# Altium schematic sheet DBBC7505S-F.SchDoc
size A2; SheetNumber: 1; SheetTotal: 1
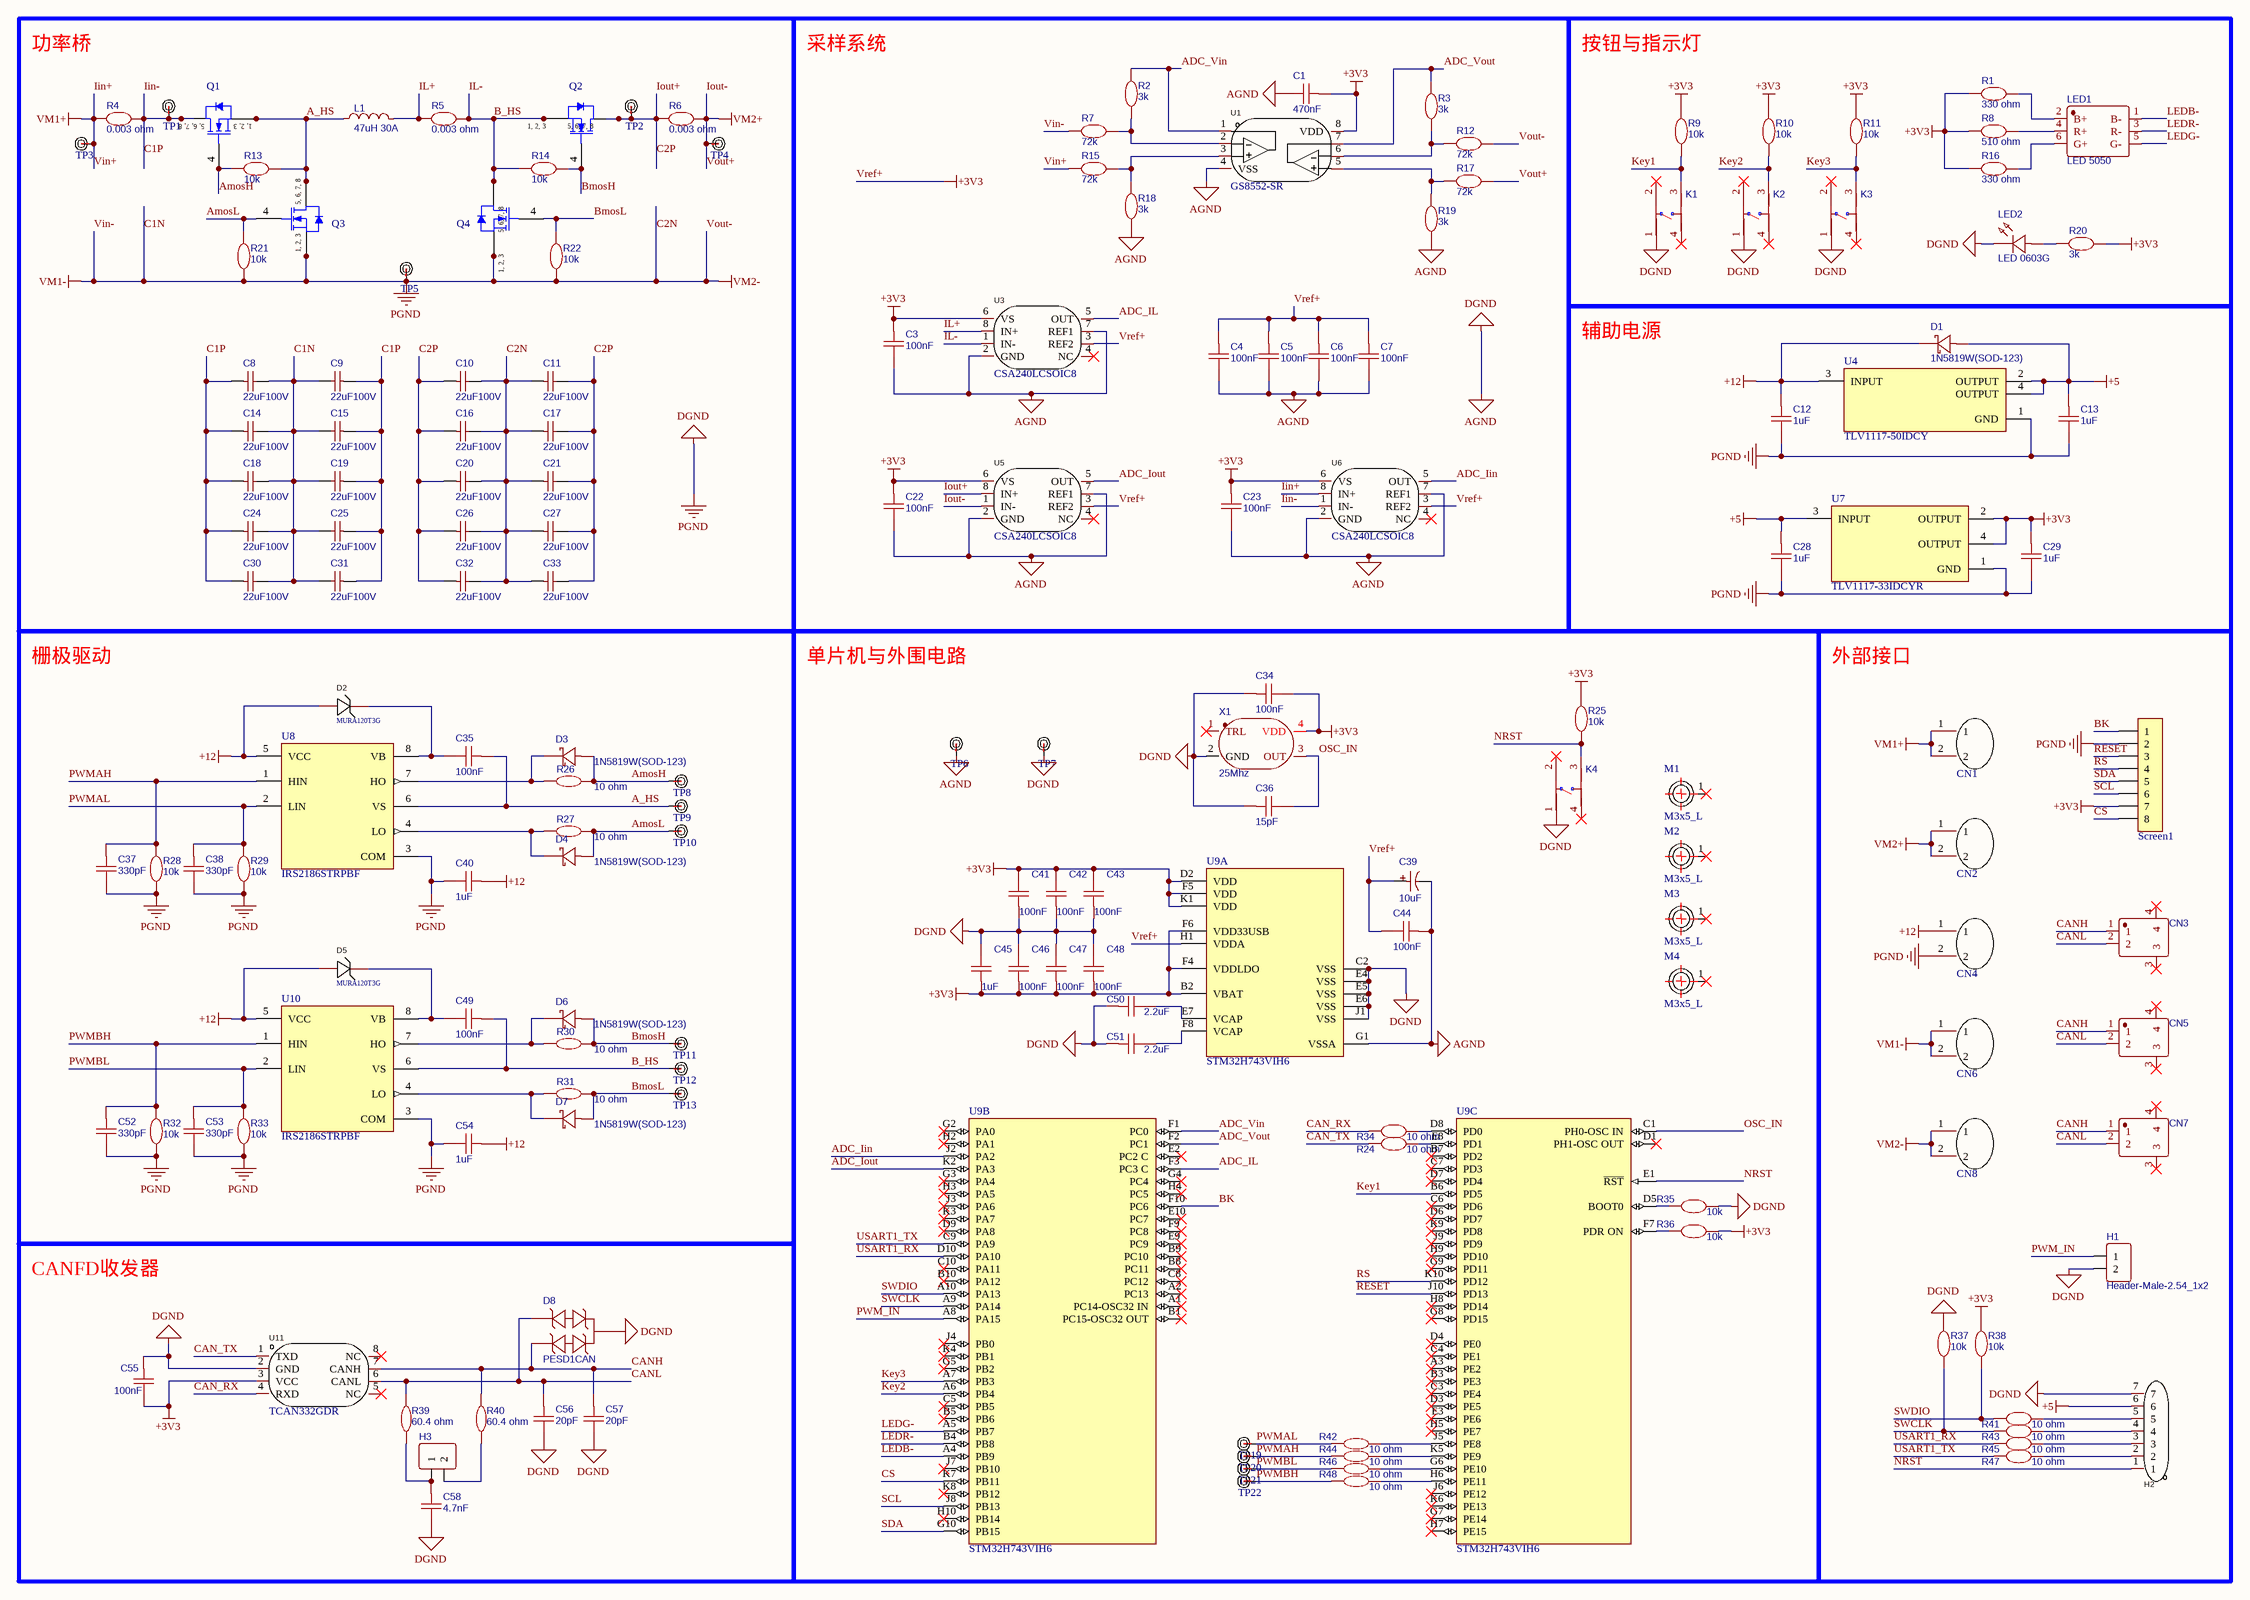
[diagram p0: DBBC7505S-F.SchDoc]

## Parts
C1  470nF  [C0402]
C3  100nF  [C0402]
C4  100nF  [C0402]
C5  100nF  [C0402]
C6  100nF  [C0402]
C7  100nF  [C0402]
C8  22uF100V  [C1206]
C9  22uF100V  [C1206]
C10  22uF100V  [C1206]
C11  22uF100V  [C1206]
C12  1uF  [C0402]
C13  1uF  [C0402]
C14  22uF100V  [C1206]
C15  22uF100V  [C1206]
C16  22uF100V  [C1206]
C17  22uF100V  [C1206]
C18  22uF100V  [C1206]
C19  22uF100V  [C1206]
C20  22uF100V  [C1206]
C21  22uF100V  [C1206]
C22  100nF  [C0402]
C23  100nF  [C0402]
C24  22uF100V  [C1206]
C25  22uF100V  [C1206]
C26  22uF100V  [C1206]
C27  22uF100V  [C1206]
C28  1uF  [C0402]
C29  1uF  [C0402]
C30  22uF100V  [C1206]
C31  22uF100V  [C1206]
C32  22uF100V  [C1206]
C33  22uF100V  [C1206]
C34  100nF  [C0402]
C35  100nF  [C0402]
C36  15pF  [C0402]
C37  330pF  [C0402]
C38  330pF  [C0402]
C39  10uF  [CD A(3216)]
C40  1uF  [C0402]
C41  100nF  [C0402]
C42  100nF  [C0402]
C43  100nF  [C0402]
C44  100nF  [C0402]
C45  1uF  [C0402]
C46  100nF  [C0402]
C47  100nF  [C0402]
C48  100nF  [C0402]
C49  100nF  [C0402]
C50  2.2uF  [C0402]
C51  2.2uF  [C0402]
C52  330pF  [C0402]
C53  330pF  [C0402]
C54  1uF  [C0402]
C55  100nF  [C0402]
C56  20pF  [C0402]
C57  20pF  [C0402]
C58  4.7nF  [C0402]
CN1  1729128  [CONN-TH_2P-P5.08]  (value not drawn)
CN2  1729128  [CONN-TH_2P-P5.08]  (value not drawn)
CN3  A1257WR-S-2P  [CONN-SMD_A1257WR-S-2P]  (value not drawn)
CN4  1729128  [CONN-TH_2P-P5.08]  (value not drawn)
CN5  A1257WR-S-2P  [CONN-SMD_A1257WR-S-2P]  (value not drawn)
CN6  1729128  [CONN-TH_2P-P5.08]  (value not drawn)
CN7  A1257WR-S-2P  [CONN-SMD_A1257WR-S-2P]  (value not drawn)
CN8  1729128  [CONN-TH_2P-P5.08]  (value not drawn)
D1  1N5819W(SOD-123)  [SOD-123]
D2  MURA120T3G  [SMA]
D3  1N5819W(SOD-123)  [SOD-123]
D4  1N5819W(SOD-123)  [SOD-123]
D5  MURA120T3G  [SMA]
D6  1N5819W(SOD-123)  [SOD-123]
D7  1N5819W(SOD-123)  [SOD-123]
D8  PESD1CAN  [SOT23-3L]
H1  Header-Male-2.54_1x2  [HDR2.54-LI-2P]
H2  7P卧贴排母  [HDR-SMD_7P-P2.54-H-F-L11.5]  (value not drawn)
H3  Header-Male-2.54_1x2  [HDR2.54-LI-2P]  (value not drawn)
K1  TSW SMD-6*6*5  [TSW SMD-6*6*5]  (value not drawn)
K2  TSW SMD-6*6*5  [TSW SMD-6*6*5]  (value not drawn)
K3  TSW SMD-6*6*5  [TSW SMD-6*6*5]  (value not drawn)
K4  TSW SMD-6*6*5  [TSW SMD-6*6*5]  (value not drawn)
L1  47uH 30A  [106-125卧式]
LED1  LED 5050  [LED 5050]
LED2  LED 0603G  [LED 0603G]
M1  M3x5_L  [M3x5_L]
M2  M3x5_L  [M3x5_L]
M3  M3x5_L  [M3x5_L]
M4  M3x5_L  [M3x5_L]
Q1  BSC070N10NS3 G  [INF-PG-TDSON-8-1_V]  (value not drawn)
Q2  BSC070N10NS3 G  [INF-PG-TDSON-8-1_V]  (value not drawn)
Q3  BSC070N10NS3 G  [INF-PG-TDSON-8-1_V]  (value not drawn)
Q4  BSC070N10NS3 G  [INF-PG-TDSON-8-1_V]  (value not drawn)
R1  330 ohm  [R0402]
R2  3k  [R0402]
R3  3k  [R0402]
R4  0.003 ohm  [R2512]
R5  0.003 ohm  [R2512]
R6  0.003 ohm  [R2512]
R7  72k  [R0402]
R8  510 ohm  [R0402]
R9  10k  [R0402]
R10  10k  [R0402]
R11  10k  [R0402]
R12  72k  [R0402]
R13  10k  [R0402]
R14  10k  [R0402]
R15  72k  [R0402]
R16  330 ohm  [R0402]
R17  72k  [R0402]
R18  3k  [R0402]
R19  3k  [R0402]
R20  3k  [R0402]
R21  10k  [R0402]
R22  10k  [R0402]
R24  10 ohm  [R0402]
R25  10k  [R0402]
R26  10 ohm  [R0603]
R27  10 ohm  [R0603]
R28  10k  [R0402]
R29  10k  [R0402]
R30  10 ohm  [R0603]
R31  10 ohm  [R0603]
R32  10k  [R0402]
R33  10k  [R0402]
R34  10 ohm  [R0402]
R35  10k  [R0402]
R36  10k  [R0402]
R37  10k  [R0402]
R38  10k  [R0402]
R39  60.4 ohm  [R0603]
R40  60.4 ohm  [R0603]
R41  10 ohm  [R0402]
R42  10 ohm  [R0603]
R43  10 ohm  [R0402]
R44  10 ohm  [R0603]
R45  10 ohm  [R0402]
R46  10 ohm  [R0603]
R47  10 ohm  [R0402]
R48  10 ohm  [R0603]
Screen1  FPC0.5-8P  [FPC0.5 2H-S-W-8P]  (value not drawn)
TP1  TestPoint_DIP  [TestPoint_DIP]  (value not drawn)
TP2  TestPoint_DIP  [TestPoint_DIP]  (value not drawn)
TP3  TestPoint_DIP  [TestPoint_DIP]  (value not drawn)
TP4  TestPoint_DIP  [TestPoint_DIP]  (value not drawn)
TP5  TestPoint_DIP  [TestPoint_DIP]  (value not drawn)
TP6  TestPoint_DIP  [TestPoint_DIP]  (value not drawn)
TP7  TestPoint_DIP  [TestPoint_DIP]  (value not drawn)
TP8  TestPoint_DIP  [TestPoint_DIP]  (value not drawn)
TP9  TestPoint_DIP  [TestPoint_DIP]  (value not drawn)
TP10  TestPoint_DIP  [TestPoint_DIP]  (value not drawn)
TP11  TestPoint_DIP  [TestPoint_DIP]  (value not drawn)
TP12  TestPoint_DIP  [TestPoint_DIP]  (value not drawn)
TP13  TestPoint_DIP  [TestPoint_DIP]  (value not drawn)
TP19  TestPoint_DIP  [TestPoint_DIP]  (value not drawn)
TP20  TestPoint_DIP  [TestPoint_DIP]  (value not drawn)
TP21  TestPoint_DIP  [TestPoint_DIP]  (value not drawn)
TP22  TestPoint_DIP  [TestPoint_DIP]  (value not drawn)
U1  GS8552-SR  [SOIC-8_L4.9-W3.9-P1.27-LS6.0-BL]
U3  CSA240LCSOIC8  [SOIC-8_L4.9-W3.9-P1.27-LS6.0-BL]
U4  TLV1117-50IDCY  [FP-DCY0004A-MFG]
U5  CSA240LCSOIC8  [SOIC-8_L4.9-W3.9-P1.27-LS6.0-BL]
U6  CSA240LCSOIC8  [SOIC-8_L4.9-W3.9-P1.27-LS6.0-BL]
U7  TLV1117-33IDCYR  [FP-DCY0004A-MFG]
U8  IRS2186STRPBF  [FP-PG-DSO-8-IPC_B]
U9  STM32H743VIH6  [FP-TFBGA100-A08Q-MFG]  (parts A,B,C of 3)
U10  IRS2186STRPBF  [FP-PG-DSO-8-IPC_B]
U11  TCAN332GDR  [SOIC-8_L4.9-W3.9-P1.27-LS6.0-BL]
X1  25Mhz  [OSC 3225-4P]

## Blocks framed on the sheet
功率桥: C8-C11 C14-C21 C24-C27 C30-C33 L1 Q1-Q4 R4-R6 R13 R14 R21 R22 TP1-TP5
采样系统: C1 C3-C7 C22 C23 R2 R3 R7 R12 R15 R17-R19 U1 U3 U5 U6
按钮与指示灯: K1-K3 LED1 LED2 R1 R8-R11 R16 R20
辅助电源: C12 C13 C28 C29 D1 U4 U7
栅极驱动: C35 C37 C38 C40 C49 C52-C54 D2-D7 R26-R33 TP8-TP13 U8 U10
单片机与外围电路: C34 C36 C39 C41-C48 C50 C51 K4 M1-M4 R24 R25 R34-R36 R42 R44 R46 R48 TP6 TP7 TP19-TP22 U9 X1
外部接口: CN1-CN8 H1 H2 R37 R38 R41 R43 R45 R47 Screen1
CANFD收发器: C55-C58 D8 H3 R39 R40 U11

## Nets
+5: C13.2 C28.2 D1.1(A) H2.6 U4.2(OUTPUT) U4.4(OUTPUT) U7.3(INPUT)
+12: C12.2 C40.2 C54.2 CN4.1 D1.2(K) D2.1(A) D5.1(A) U4.3(INPUT) U8.5(VCC) U10.5(VCC)
C1N: C1.1 C3.1 C4.1 C5.1 C6.1 C7.1 C8.2 C9.2 C10.2 C11.1 C12.1 C13.1 C14.2 C15.2 C16.2 C17.1 C18.2 C19.2 C20.2 C21.1 C22.1 C23.1 C24.2 C25.2 C26.2 C27.1 C28.1 C29.1 C30.2 C31.2 C32.2 C33.1 C34.2 C36.2 C37.1 C38.1 C39.2 C40.1 C41.2 C42.2 C43.2 C44.2 C45.1 C46.1 C47.1 C48.1 C50.2 C51.2 C52.1 C53.1 C54.1 C55.2 C56.1 C57.1 C58.1 CN4.2 CN6.1 CN6.2 CN8.1 CN8.2 D8.3 H1.2 H2.7 K1.1 K2.1 K3.1 K4.1 LED2.2(K) Q3.1(SOURCE) Q3.2(SOURCE) Q3.3(SOURCE) Q4.1(SOURCE) Q4.2(SOURCE) Q4.3(SOURCE) R7.2 R12.1 R18.1 R19.1 R21.1 R22.1 R28.1 R29.1 R32.1 R33.1 R35.1 R37.1 Screen1.2 TP5.1 TP6.1 TP7.1 U1.4(VSS) U3.2(GND) U3.7(REF1) U4.1(GND) U5.2(GND) U5.7(REF1) U6.2(GND) U6.7(REF1) U7.1(GND) U8.3(COM) U9.C2(VSS) U9.E4(VSS) U9.E5(VSS) U9.E6(VSS) U9.G1(VSSA) U9.J1(VSS) U10.3(COM) U11.2(GND) X1.2(GND)  [also labelled AGND, C2N, DGND, PGND, Vin-, VM1-, VM2-, Vout-]
Iin+: CN1.1 CN1.2 R4.1 R15.2 TP3.1 U6.8(IN+)  [also labelled Vin+, VM1+]
Iout-: CN2.1 CN2.2 R6.2 R17.1 TP4.1 U5.1(IN-)  [also labelled VM2+, Vout+]
Vref+: C1.2 C3.2 C4.2 C5.2 C6.2 C7.2 C22.2 C23.2 C29.2 C34.1 C39.1 C41.1 C42.1 C43.1 C44.1 C45.2 C46.2 C47.2 C48.2 C55.1 R1.2 R8.2 R9.2 R10.2 R11.2 R16.1 R20.1 R25.1 R36.1 R38.1 Screen1.7 U1.8(VDD) U3.3(REF2) U3.6(VS) U5.3(REF2) U5.6(VS) U6.3(REF2) U6.6(VS) U7.2(OUTPUT) U7.4(OUTPUT) U9.B2(VBAT) U9.D2(VDD) U9.F4(VDDLDO) U9.F5(VDD) U9.F6(VDD33USB) U9.H1(VDDA) U9.K1(VDD) U11.3(VCC) X1.4(VDD)  [also labelled +3V3]
A_HS: C35.2 L1.1 Q1.1(SOURCE) Q1.2(SOURCE) Q1.3(SOURCE) Q3.5(DRAIN) Q3.6(DRAIN) Q3.7(DRAIN) Q3.8(DRAIN) R13.2 TP9.1 U8.6(VS)
ADC_Iin: U6.5(OUT) U9.J2(PA2)
ADC_IL: U3.5(OUT) U9.F3(PC3_C)
ADC_Iout: U5.5(OUT) U9.K2(PA3)
ADC_Vin: R2.2 U1.1(OUTA) U9.F1(PC0)
ADC_Vout: R3.2 U1.7(OUTB) U9.F2(PC1)
AmosH: D3.1(A) Q1.4(GATE) R13.1 R26.2 TP8.1
AmosL: D4.1(A) Q3.4(GATE) R21.2 R27.2 TP10.1
B_HS: C49.2 Q2.1(SOURCE) Q2.2(SOURCE) Q2.3(SOURCE) Q4.5(DRAIN) Q4.6(DRAIN) Q4.7(DRAIN) Q4.8(DRAIN) R5.2 R14.1 TP12.1 U3.1(IN-) U10.6(VS)  [also labelled IL-]
BK: Screen1.1 U9.F10(PC6)
BmosH: D6.1(A) Q2.4(GATE) R14.2 R30.2 TP11.1
BmosL: D7.1(A) Q4.4(GATE) R22.2 R31.2 TP13.1
C1P: C8.1 C9.1 C14.1 C15.1 C18.1 C19.1 C24.1 C25.1 C30.1 C31.1 Q1.5(DRAIN) Q1.6(DRAIN) Q1.7(DRAIN) Q1.8(DRAIN) R4.2 TP1.1 U6.1(IN-)  [also labelled Iin-]
C2P: C10.1 C11.2 C16.1 C17.2 C20.1 C21.2 C26.1 C27.2 C32.1 C33.2 Q2.5(DRAIN) Q2.6(DRAIN) Q2.7(DRAIN) Q2.8(DRAIN) R6.1 TP2.1 U5.8(IN+)  [also labelled Iout+]
CAN_RX: R34.2 U11.4(RXD)
CAN_TX: R24.2 U11.1(TXD)
CANH: C57.2 CN3.1 CN5.1 CN7.1 D8.2 R40.2 U11.7(CANH)
CANL: C56.2 CN3.2 CN5.2 CN7.2 D8.1 R39.2 U11.6(CANL)
CS: Screen1.8 U9.K7(PB11)
IL+: L1.2 R5.1 U3.8(IN+)
Key1: K1.3 R9.1 U9.B6(PD5)
Key2: K2.3 R10.1 U9.A6(PB4)
Key3: K3.3 R11.1 U9.A7(PB3)
LEDB-: LED1.1(B-) U9.A4(PB9)
LEDG-: LED1.5(G-) U9.A5(PB7)
LEDR-: LED1.3(R-) U9.B4(PB8)
NRST: H2.1 K4.3 R25.2 U9.E1(~{RST})
OSC_IN: C36.1 U9.C1(PH0-OSC_IN) X1.3(OUT)
PWM_IN: H1.1 U9.A8(PA15)
PWMAH: C37.2 R28.2 R44.2 TP20.1 U8.1(HIN)
PWMAL: C38.2 R29.2 R42.2 TP19.1 U8.2(LIN)
PWMBH: C52.2 R32.2 R48.2 TP22.1 U10.1(HIN)
PWMBL: C53.2 R33.2 R46.2 TP21.1 U10.2(LIN)
RESET: Screen1.3 U9.J10(PD13)
RS: Screen1.4 U9.K10(PD12)
SCL: Screen1.6 U9.J8(PB13)
SDA: Screen1.5 U9.G10(PB15)
SWCLK: R37.2 R43.2 U9.A9(PA14)
SWDIO: R38.2 R41.2 U9.A10(PA13)
USART1_RX: R45.2 U9.D10(PA10)
USART1_TX: R47.2 U9.C9(PA9)
NetC35_1: C35.1 D2.2(C) U8.8(VB)
NetC49_1: C49.1 D5.2(C) U10.8(VB)
NetC50_1: C50.1 U9.E7(VCAP)
NetC51_1: C51.1 U9.F8(VCAP)
NetC58_2: C58.2 H3.1 R39.1
NetD3_2: D3.2(K) R26.1 U8.7(HO)
NetD4_2: D4.2(K) R27.1 U8.4(LO)
NetD6_2: D6.2(K) R30.1 U10.7(HO)
NetD7_2: D7.2(K) R31.1 U10.4(LO)
NetH2_2: H2.2 R47.1
NetH2_3: H2.3 R45.1
NetH2_4: H2.4 R43.1
NetH2_5: H2.5 R41.1
NetH3_2: H3.2 R40.1
NetLED1_2: LED1.2(B+) R1.1
NetLED1_4: LED1.4(R+) R8.1
NetLED1_6: LED1.6(G+) R16.2
NetLED2_1: LED2.1(A) R20.2
NetR2_1: R2.1 R7.1 U1.2(INA-)
NetR3_1: R3.1 R12.2 U1.6(INB-)
NetR15_1: R15.1 R18.2 U1.3(INA+)
NetR17_2: R17.2 R19.2 U1.5(INB+)
NetR24_1: R24.1 U9.E8(PD1)
NetR34_1: R34.1 U9.D8(PD0)
NetR35_2: R35.2 U9.D5(BOOT0)
NetR36_2: R36.2 U9.F7(PDR_ON)
NetR42_1: R42.1 U9.J5(PE8)
NetR44_1: R44.1 U9.K5(PE9)
NetR46_1: R46.1 U9.G6(PE10)
NetR48_1: R48.1 U9.H6(PE11)

Not connected (* = marked no-connect by the designer): CN3 3* 4*; CN5 3* 4*; CN7 3* 4*; K1 2* 4*; K2 2* 4*; K3 2* 4*; K4 2* 4*; M1 1*; M2 1*; M3 1*; M4 1*; U3 4(NC)*; U5 4(NC)*; U6 4(NC)*; U9 A1(PC14-OSC32_IN)* A2(PC13)* A3(PE2)* B1(PC15-OSC32_OUT)* B3(PE3)* B5(PB6)* B7(PD2)* B8(PC11)* B9(PC10)* B10(PA12)* C3(PE4)* C4(PE1)* C5(PB5)* C6(PD6)* C7(PD3)* C8(PC12)* C10(PA11)* D1(PH1-OSC_OUT)* D3(PE5)* D4(PE0)* D6(PD7)* D7(PD4)* D9(PA8)* E2(PC2_C)* E3(PE6)* E9(PC9)* E10(PC7)* F9(PC8)* G2(PA0)* G3(PA4)* G4(PC4)* G5(PB2)* G7(PE14)* G8(PD15)* G9(PD11)* H2(PA1)* H3(PA5)* H4(PC5)* H5(PE7)* H7(PE15)* H8(PD14)* H9(PD10)* H10(PB14)* J3(PA6)* J4(PB0)* J6(PE12)* J7(PB10)* J9(PD9)* K3(PA7)* K4(PB1)* K6(PE13)* K8(PB12)* K9(PD8)*; U11 5(NC)* 8(NC)*; X1 1(TRL)*

## Notes on the sheet
- (in symbol BSC070N10NS3G) 5, 6, 7, 8; 1, 2, 3

## Library data of the parts
C1 C3-C7 C12 C13 C22 C23 C28 C29 C34-C38 C40-C58 = C0402: BOM_Manufacturer: YAGEO; BOM_Manufacturer Part: CC0402KRX7R7BB104; nameAlias: Capacitance; BOM_Supplier: LCSC; BOM_Supplier Part: C60474; BOM_JLCPCB Part Class: Extended Part; spicePre: C; spiceSymbolName: CC0402KRX7R7BB104
C8-C11 C14-C21 C24-C27 C30-C33 = C1206: BOM_Manufacturer: FH; BOM_Manufacturer Part: 1206B102K202NT; nameAlias: Capacitance; BOM_Supplier: LCSC; BOM_Supplier Part: C9196; BOM_JLCPCB Part Class: Basic Part; spicePre: C; spiceSymbolName: 1206B102K202NT
C39 = A型钽电容: 长3.2mm，宽1.6mm，厚1.6mm; BOM_Manufacturer: ValuePro; BOM_Manufacturer Part: 50V 100uF 8X12; nameAlias: Capacitance; BOM_Supplier: LCSC; BOM_Supplier Part: C2749; BOM_JLCPCB Part Class: Extended Part; spicePre: C; spiceSymbolName: 50V 100uF 8X12
CN1 CN2 CN4 CN6 CN8 = MKDSN5.08-2P: 间距:5.08mm;排数:1;每排PIN数:2;安装方式:直针;额定电流:13.5A;额定电压:400V;工作温度范围:-;颜色:绿色;; Manufacturer: Phoenix Contact(菲尼克斯); Symbol: MKDSN1.5/2-5.08; Add into BOM: yes; Pitch: 5.08mm; Number of PINs Per Row: 2; Current Rating (Max): 13.5A; Voltage Rating (Max): 400V; Device: 1729128; LCSC Part Name: 5.08mm 排数:1 每排P数:2 直针; Supplier Part: C91153; Manufacturer Part: 1729128; Supplier Footprint: 插件,P=5.08mm; JLCPCB Part Class: Extended Part; Datasheet: https://atta.szlcsc.com/upload/public/pdf/source/20161226/1482720163948.pdf; Supplier: LCSC; Convert to PCB: yes; Number of Rows: 1; Mounting Style: 直针; Operating Temperature Range: -; Color: 绿色
CN3 CN5 CN7 = A1257WR-S-2P: BOM_Manufacturer: Changjiang Connectors; BOM_Manufacturer Part: A1257WV-S-2P; Contributor: LCSC; BOM_Supplier: LCSC; BOM_Supplier Part: C225118; BOM_JLCPCB Part Class: Extended Part; spicePre: C; spiceSymbolName: A1257WV-S-2P
D1 D3 D4 D6 D7 = 1N5819W(SOD-123): BOM_Manufacturer: Doeshare(德芯); BOM_Manufacturer Part: SS34; Contributor: LCSC; BOM_Supplier: LCSC; BOM_Supplier Part: C2931787; BOM_JLCPCB Part Class: Extended Part; spicePre: D; spiceSymbolName: SS34_C2931787
D2 D5 = MURA120T3G: 25ns 0.875V压降 1A快恢复二极管; Manufacturer: MDD; Name: ES1J; Symbol: ES1JG_C412438; Device: ES1J_C412438; Add into BOM: yes; Diode Configuration: 独立式; Reverse Voltage (Vr): 600V; Average Rectified Current (Io): 1A; Forward Voltage (Vf@If): 1.7V@1A; Reverse Leakage Current: 5uA@600V; Reverse Recovery Time (trr): 35ns; LCSC Part Name: 600V 1A 35ns; Supplier Part: C412438; Manufacturer Part: ES1J; Supplier Footprint: SMA; JLCPCB Part Class: Extended Part; Datasheet: https://atta.szlcsc.com/upload/public/pdf/source/20200710/C412438_D778E045B8BDD674EB487A7C2F57C90E.pdf; Supplier: LCSC; Convert to PCB: yes; Operating Temperature: -55℃~+150℃@(Tj)
D8 = PESD1CAN: BOM_Manufacturer: TECH PUBLIC; Contributor: LCSC; BOM_Supplier: LCSC; BOM_Supplier Part: C907838; BOM_Manufacturer Part: PESD1CAN; spicePre: D; spiceSymbolName: PESD1CAN_C907838
H1 H3 = Header-Male-2.54_1x2: BOM_Manufacturer: BOOMELE; BOM_Manufacturer Part: Header2.54mm 1*3P; BOM_Supplier: LCSC; BOM_Supplier Part: C49257; BOM_JLCPCB Part Class: Extended Part; spicePre: H; spiceSymbolName: Header-Male-2.54_1x3
H2 = 7P卧贴排母: Manufacturer: XKB Connectivity(中国星坤); Name: X6511FRS-06-C85D30; Add into BOM: yes; Holes Structure: 1x6P; Pitch: 2.54mm; Number of Holes: 6P; Symbol: X6511FRS-06-C85D30; Device: X6511FRS-06-C85D30; LCSC Part Name: 间距:2.54mm 1x6P 卧贴; Supplier Part: C5142239; Manufacturer Part: X6511FRS-06-C85D30; Supplier Footprint: SMD,P=2.54mm; JLCPCB Part Class: Extended Part; Datasheet: https://atta.szlcsc.com/upload/public/pdf/source/20220822/AB9A82E80C220285963E5EFA3BFD32FF.pdf; Supplier: LCSC; Convert to PCB: yes; Mounting Type: 卧贴; Number of Rows: 单排; Insulation Height: 8.5mm
K1-K4 = TSW SMD-6*6*5: BOM_Manufacturer: GANGYUAN(港源); BOM_Manufacturer Part: KAN0661-1001B; Contributor: LCSC; BOM_Supplier: LCSC; BOM_Supplier Part: C231715; BOM_JLCPCB Part Class: Extended Part; spicePre: S; spiceSymbolName: KAN0661-1001B
L1 = 106-125铁硅铝磁环电感: BOM_Manufacturer: FH(风华); BOM_Manufacturer Part: HA42-4R7MT; nameAlias: Inductance; Contributor: LCSC; BOM_Supplier: LCSC; BOM_Supplier Part: C2936653; BOM_JLCPCB Part Class: Extended Part; spicePre: L; spiceSymbolName: HA42-4R7MT
LED1 = LED 5050: 5050RGB-LED; BOM_Manufacturer: EVERLIGHT(台湾亿光); BOM_Manufacturer Part: 11-21/BHC-AQ2S2/2T; Contributor: lcsc; BOM_Supplier: LCSC; BOM_Supplier Part: C3014404; spicePre: L; spiceSymbolName: 11-21/BHC-AQ2S2/2T
LED2 = LED 0603G: 绿色0603LED; BOM_Manufacturer: EVERLIGHT(台湾亿光); BOM_Manufacturer Part: 11-21/BHC-AQ2S2/2T; Contributor: lcsc; BOM_Supplier: LCSC; BOM_Supplier Part: C3014404; spicePre: L; spiceSymbolName: 11-21/BHC-AQ2S2/2T
M1-M4 = M3x5_L: M3铜柱，长：5mm
Q1-Q4 = BSC070N10NS3G: N-Channel OptiMOS 3 Power-Transistor, 100 V VDS, 90 A ID, -55 to 150 degC, PG-TDSON-8-1, Reel, Green; Manufacturer: Infineon; QG: 42Â nC; VGS(th) (min): 2Â V; RDS (on) (max): 7Â mOhm; ID (max): 90Â A; Polarity: N; RthJC (max): 1.1Â K/W; RthJA (max): 50Â K/W; VDS (max): 100Â V; Ptot (max): 114Â W; VGS(th) (max): 3.5Â V; IDpuls (max): 360Â A; Green: TRUE; ComponentLink2Description: Datasheet; DatasheetVersion: Rev. 2.0; Mounting Technology: Surface Mount; ComponentLink1Description: Manufacturer URL; ComponentLink3Description: Package Specification; ComponentLink1URL: http://www.infineon.com/; PackageDescription: 8-Pin Plastic (Green) Thin Dual Small Outline Non-Leaded Package, 5.15 x 5.9 mm Body, 1.27 mm Pitch; Packing: Reel; ComponentLink3URL: http://www.infineon.com/cms/packages/SMD_-_Surface_Mounted_Devices/P-PG-TDSON/P-PG-TDSON-08-01x_2x_3.html?__locale=en; PackageReference: PG-TDSON-8-1; PartNumber: BSC070N10NS3 G; Halogen-free: TRUE; Rth: 1.1Â K/W; ComponentLink2URL: http://www.infineon.com/dgdl/BSC070N10NS3+Rev2+1.pdf?folderId=db3a304313b8b5a60113cee8763b02d7&fileId=db3a304327b89750012824712c6c6f2f; Manufacturer Part Number: BSC070N10NS3G
R1-R3 R7-R22 R24 R25 R28 R29 R32-R38 R41 R43 R45 R47 = R0402: BOM_Manufacturer: YAGEO; BOM_Manufacturer Part: SR0402FR-0710KL; Contributor: LCSC; Resistance: 10kΩ; BOM_Supplier: LCSC; BOM_Supplier Part: C723595; BOM_JLCPCB Part Class: Extended Part; spicePre: R; spiceSymbolName: SR0402FR-0710KL
R4-R6 = R2512: BOM_Manufacturer: YAGEO; BOM_Manufacturer Part: SR2512FK-0751RL; nameAlias: Resistance (Ohms); Contributor: LCSC; Resistance: 51Ω; BOM_Supplier: LCSC; BOM_Supplier Part: C375694; BOM_JLCPCB Part Class: Extended Part; spicePre: R; spiceSymbolName: SR2512FK-0751RL
R26 R27 R30 R31 R39 R40 R42 R44 R46 R48 = R0603: BOM_Manufacturer: YAGEO; BOM_Manufacturer Part: SR0603JR-071RL; nameAlias: Resistance (Ohms); Contributor: LCSC; Resistance: 1Ω; BOM_Supplier: LCSC; BOM_Supplier Part: C326890; BOM_JLCPCB Part Class: Extended Part; spicePre: R; spiceSymbolName: SR0603JR-071RL
Screen1 = FPC-8P-0.5: FPC连接器; 版权归属: 黎明电子style; BOM名称: FPC连接器; 学习资源: https://lmdzstyle.taobao.com/
TP1-TP13 TP19-TP22 = TestPoint_DIP: 测试点
U1 = GS8552-SR: 1.5MHZ, 轨到轨高精双通道运放; Manufacturer: Gainsil(聚洵); Add into BOM: yes; Number of Circuits: 双路; Supply Voltage: 1.8V~5.5V; Gain Bandwidth Product(GBP): 1.8MHz; Slew Rate(SR): 0.95V/us; Supply Current: 180uA; Name: GS8552-SR; Symbol: GS8552-SR; Device: GS8552-SR; LCSC Part Name: GS8552-SR; Supplier Part: C157716; Manufacturer Part: GS8552-SR; Supplier Footprint: SOIC-8; JLCPCB Part Class: Extended Part; Datasheet: https://atta.szlcsc.com/upload/public/pdf/source/20200615/C605420_EE0E567F8FF01D919583B114644E1CC3.pdf; Supplier: LCSC; Convert to PCB: yes; Operating Temperature: -40℃~+125℃
U3 U5 U6 = CSA240LCSOIC8: 低噪声低温漂双向电流高端检测芯片; Manufacturer: analogysemi(类比半导体); Add into BOM: yes; Number of Channels: 1; Common Mode Voltage: 6V~80V; Gain: 20V/V; Supply Voltage: 2.7V~5.5V; Name: CSA240LCSOIC8; Symbol: CSA240LCSOIC8; Device: CSA240LCSOIC8; LCSC Part Name: 线性产品; Supplier Part: C5359411; Manufacturer Part: CSA240LCSOIC8; Supplier Footprint: SOIC-8; JLCPCB Part Class: Extended Part; Datasheet: https://atta.szlcsc.com/upload/public/pdf/source/20230221/4ACBE0500A397B3D4468D76F97F173B7.pdf; Supplier: LCSC; Convert to PCB: yes; Operating Temperature: -40℃~125℃
U4 = CMP-04917-000165-1: IC REG LINEAR 5V 800MA SOT223-4; Dropout Voltage: 1.2V; Input Bias Current: 5mA; Output Type: Fixed; Quiescent Current: 15mA; Number of Regulators: 1; Min Input Voltage: 6.4V; Polarity: Positive; Max Input Voltage: 15V; Reference Voltage: 5.2V; Case/Package: SOT-223; Series: -; Radiation Hardening: No; Width: 3.7mm; Lead Free: Lead Free; Min Operating Temperature: -40°C; Mount: Surface Mount; Packaging: Rail/Tube; Min Current Limit: 800mA; Max Output Current: 800mA; Height: 1.7mm; Output Current: 800mA; Number of Outputs: 1; REACH SVHC: No SVHC; Nominal Output Voltage: 5V; Length: 6.7mm; Max Operating Temperature: 125°C; Output Voltage: 5V; Number of Pins: 3; Package Quantity: 80; RoHS Compliant: Yes
U7 = CMP-04917-000056-1: IC REG LIN 3.3V 800MA SOT223-4; Manufacturer: Texas Instruments; Nominal Supply Current: 5mA; Dropout Voltage: 1.2V; Max Supply Voltage: 15V; Min Supply Voltage: 4.7V; Output Type: Fixed; Number Of Outputs: 1; Output Current: 0.8A; Standoff Height: 0.02mm; Max Junction Temp: +125°C; Lead Free: Yes; RoHS: TRUE; Temperature: -40°C to +125°C; Device Class L1: Integrated Circuits (ICs); Output Voltage: 3.3V; Device Class L3: Voltage Regulators - Linear; Octopart: https://octopart.com/tlv1117-33idcyr-texas+instruments-669250; Device Class L2: Power Management ICs; Package: DCY0004A; Temperature Range High: +125°C; Category: IC; Height: 1.8mm; Automotive: No; Digikey Description: IC REG LIN 3.3V 800MA SOT223-4; Temperature Range Low: -40°C; ComponentLink2URL: http://www.ti.com/lit/ds/symlink/tlv1117.pdf; ComponentLink2Description: Datasheet; Manufacturer Part Number: TLV1117-33IDCYR; Mouser Description: LDO Voltage Regulators Fixed LDO Volt Reg
U8 U10 = CMP-32851-000154-1: IC GATE DRVR HI/LOW SIDE 8SOIC; Propagation Delay: 170ns; Number of Channels: 2; Channel Type: Independent; Output Current: 4A; Fall Time: 30ns; Halogen Free: Halogen Free; Mount: Surface Mount; RoHS Compliant: Yes; Number of Pins: 8; Height: 0.059inch; Packaging: Cut Tape; Max Operating Temperature: 150°C; Min Operating Temperature: -40°C; Case/Package: SOIC; Width: 0.157inch; Lead Free: Lead Free; Package Quantity: 2500; Series: -; Length: 0.196inch; Number of Drivers: 2; Max Output Current: 4A; Number of Outputs: 2
U9 = CMP-12105-000020-1: HIGH-PERFORMANCE AND DSP WITH DP; Manufacturer: STMicroelectronics; Ram Size: 1MBytes; Number Of A/D Converters: 3; Number Of Usb Channels: 1; Number Of Pwm Channels: 2; Number Of Timers/Counters: 22; Memory Size: 2MBytes; Data Bus Width: 32bits; Max Junction Temp: +125°C; Max Supply Voltage: 3.6V; Standoff Height: 0.15mm; Frequency: 480MHz; Number Of Adc Channels: 36; Number Of I/Os: 82; Interface: I2C,SPI,UART,USART,CAN,USB,Ethernet,I2S,SMBus; Memory Type: FLASH; Number Of I2C Channels: 4; Number Of Spi Channels: 6; Core Architecture: ARM Cortex-M7; Number Of Uart Channels: 9; Min Supply Voltage: 1.71V; Temperature Range High: +85°C; Ambient Temperature Range High: +85°C; RoHS: TRUE; Device Class L1: Integrated Circuits (ICs); Package: TFBGA100-A08Q; Temperature: -40°C to +85°C; Octopart: https://octopart.com/stm32h743vih6-stmicroelectronics-93590710; Number Of Ethernet Channels: 1; Manufacturer Part Number: STM32H743VIH6; ComponentLink2Description: Datasheet; Category: IC; Digikey Description: HIGH-PERFORMANCE AND DSP WITH DP; Number Of Cores: 1; Device Class L3: Microcontrollers; Ambient Temperature Range Low: -40°C; Temperature Range Low: -40°C; Ipc Land Pattern Name: BGA100C80P10X10_800X800X110; Automotive: No; Device Class L2: Embedded Processors and Controllers; Height: 1.1mm; Lead Free: Yes; Mouser Description: MCU 32-Bit STM32H743VI ARM Cortex M7 RISC 2MB Flash 1.8V/2.5V/3.3V 100-Pin TFBGA Tray; ComponentLink2URL: https://www.st.com/resource/en/datasheet/stm32h743vi.pdf
U11 = TCAN332GDR: CANFD收发芯片; Manufacturer: TI(德州仪器); Add into BOM: yes; Data Rate: 5Mbps; Supply Voltage: 3V~3.6V; Symbol: TCAN332GDR; Device: TCAN332GDR; LCSC Part Name: 3V~3.6V; Supplier Part: C191010; Manufacturer Part: TCAN332GDR; Supplier Footprint: SOIC-8; JLCPCB Part Class: Extended Part; Datasheet: https://www.ti.com/cn/lit/gpn/tcan337g; Supplier: LCSC; Convert to PCB: yes; Type: 收发器; Operating Temperature: -40℃~+125℃
X1 = OSC-3225: BOM_Manufacturer: TAE(雅晶鑫); BOM_Manufacturer Part: TFOM8M4RHKCNT2T; Contributor: LCSC; BOM_Supplier: LCSC; BOM_Supplier Part: C454610; BOM_JLCPCB Part Class: Extended Part; spicePre: X; spiceSymbolName: TFOM8M4RHKCNT2T